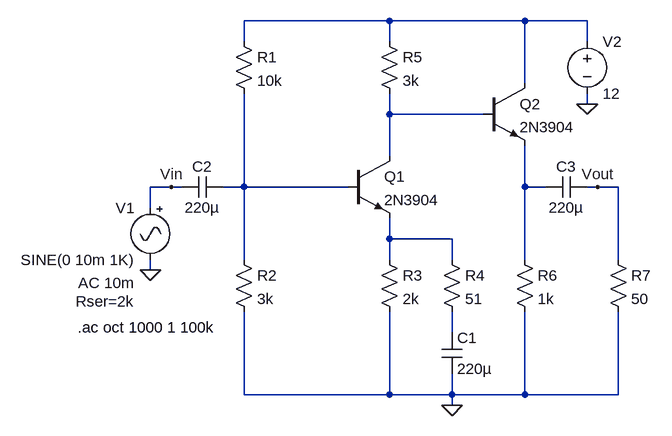
[diagram p0: schematic mic-amp.asc]
mic-amp.asc, the LTspice schematic file:
Version 4
SHEET 1 968 680
WIRE 560 -192 336 -192
WIRE 768 -192 560 -192
WIRE 864 -192 768 -192
WIRE 336 -160 336 -192
WIRE 560 -160 560 -192
WIRE 864 -160 864 -192
WIRE 768 -96 768 -192
WIRE 864 -64 864 -80
WIRE 560 -48 560 -80
WIRE 704 -48 560 -48
WIRE 560 16 560 -48
WIRE 224 64 192 64
WIRE 240 64 224 64
WIRE 336 64 336 -80
WIRE 336 64 304 64
WIRE 496 64 336 64
WIRE 768 64 768 0
WIRE 800 64 768 64
WIRE 880 64 864 64
WIRE 912 64 880 64
WIRE 192 96 192 64
WIRE 560 144 560 112
WIRE 656 144 560 144
WIRE 336 176 336 64
WIRE 560 176 560 144
WIRE 656 176 656 144
WIRE 768 176 768 64
WIRE 912 176 912 64
WIRE 192 192 192 176
WIRE 656 288 656 256
WIRE 336 384 336 256
WIRE 560 384 560 256
WIRE 560 384 336 384
WIRE 656 384 656 352
WIRE 656 384 560 384
WIRE 768 384 768 256
WIRE 768 384 656 384
WIRE 912 384 912 256
WIRE 912 384 768 384
WIRE 656 400 656 384
FLAG 656 400 0
FLAG 192 192 0
FLAG 864 -64 0
FLAG 224 64 Vin
FLAG 880 64 Vout
SYMBOL Misc\\signal 192 80 M0
WINDOW 123 24 132 Left 2
WINDOW 39 24 160 Left 2
SYMATTR InstName V1
SYMATTR Value SINE(0 10m 1K)
SYMATTR Value2 AC 10m
SYMATTR SpiceLine Rser=2k
SYMBOL npn 496 16 R0
SYMATTR InstName Q1
SYMATTR Value 2N3904
SYMBOL npn 704 -96 R0
SYMATTR InstName Q2
SYMATTR Value 2N3904
SYMBOL res 320 -176 R0
SYMATTR InstName R1
SYMATTR Value 10k
SYMBOL res 320 160 R0
SYMATTR InstName R2
SYMATTR Value 3k
SYMBOL res 544 160 R0
SYMATTR InstName R3
SYMATTR Value 2k
SYMBOL res 640 160 R0
SYMATTR InstName R4
SYMATTR Value 51
SYMBOL res 544 -176 R0
SYMATTR InstName R5
SYMATTR Value 3k
SYMBOL res 752 160 R0
SYMATTR InstName R6
SYMATTR Value 1k
SYMBOL cap 640 288 R0
SYMATTR InstName C1
SYMATTR Value 220µ
SYMBOL cap 304 48 R90
WINDOW 0 0 32 VBottom 2
WINDOW 3 32 32 VTop 2
SYMATTR InstName C2
SYMATTR Value 220µ
SYMBOL cap 864 48 R90
WINDOW 0 0 32 VBottom 2
WINDOW 3 32 32 VTop 2
SYMATTR InstName C3
SYMATTR Value 220µ
SYMBOL res 896 160 R0
SYMATTR InstName R7
SYMATTR Value 50
SYMBOL voltage 864 -176 R0
WINDOW 123 0 0 Left 0
WINDOW 39 0 0 Left 0
SYMATTR InstName V2
SYMATTR Value 12
TEXT 80 280 Left 2 !.ac oct 1000 1 100k

The netlist it stands for:
* mic-amp.asc
V1 Vin 0 SINE(0 10m 1K) AC 10m Rser=2k
Q1 N002 N003 N005 0 2N3904
Q2 N001 N002 N004 0 2N3904
R1 N001 N003 10k
R2 N003 0 3k
R3 N005 0 2k
R4 N005 N006 51
R5 N001 N002 3k
R6 N004 0 1k
C1 N006 0 220µ
C2 N003 Vin 220µ
C3 Vout N004 220µ
R7 Vout 0 50
V2 N001 0 12
.model NPN NPN
.model PNP PNP
.lib standard.bjt
.ac oct 1000 1 100k
.backanno
.end